# EAGLE schematic node5-frontend (EAGLE 5.11)
DIGIKEY: PDS340DICT-ND
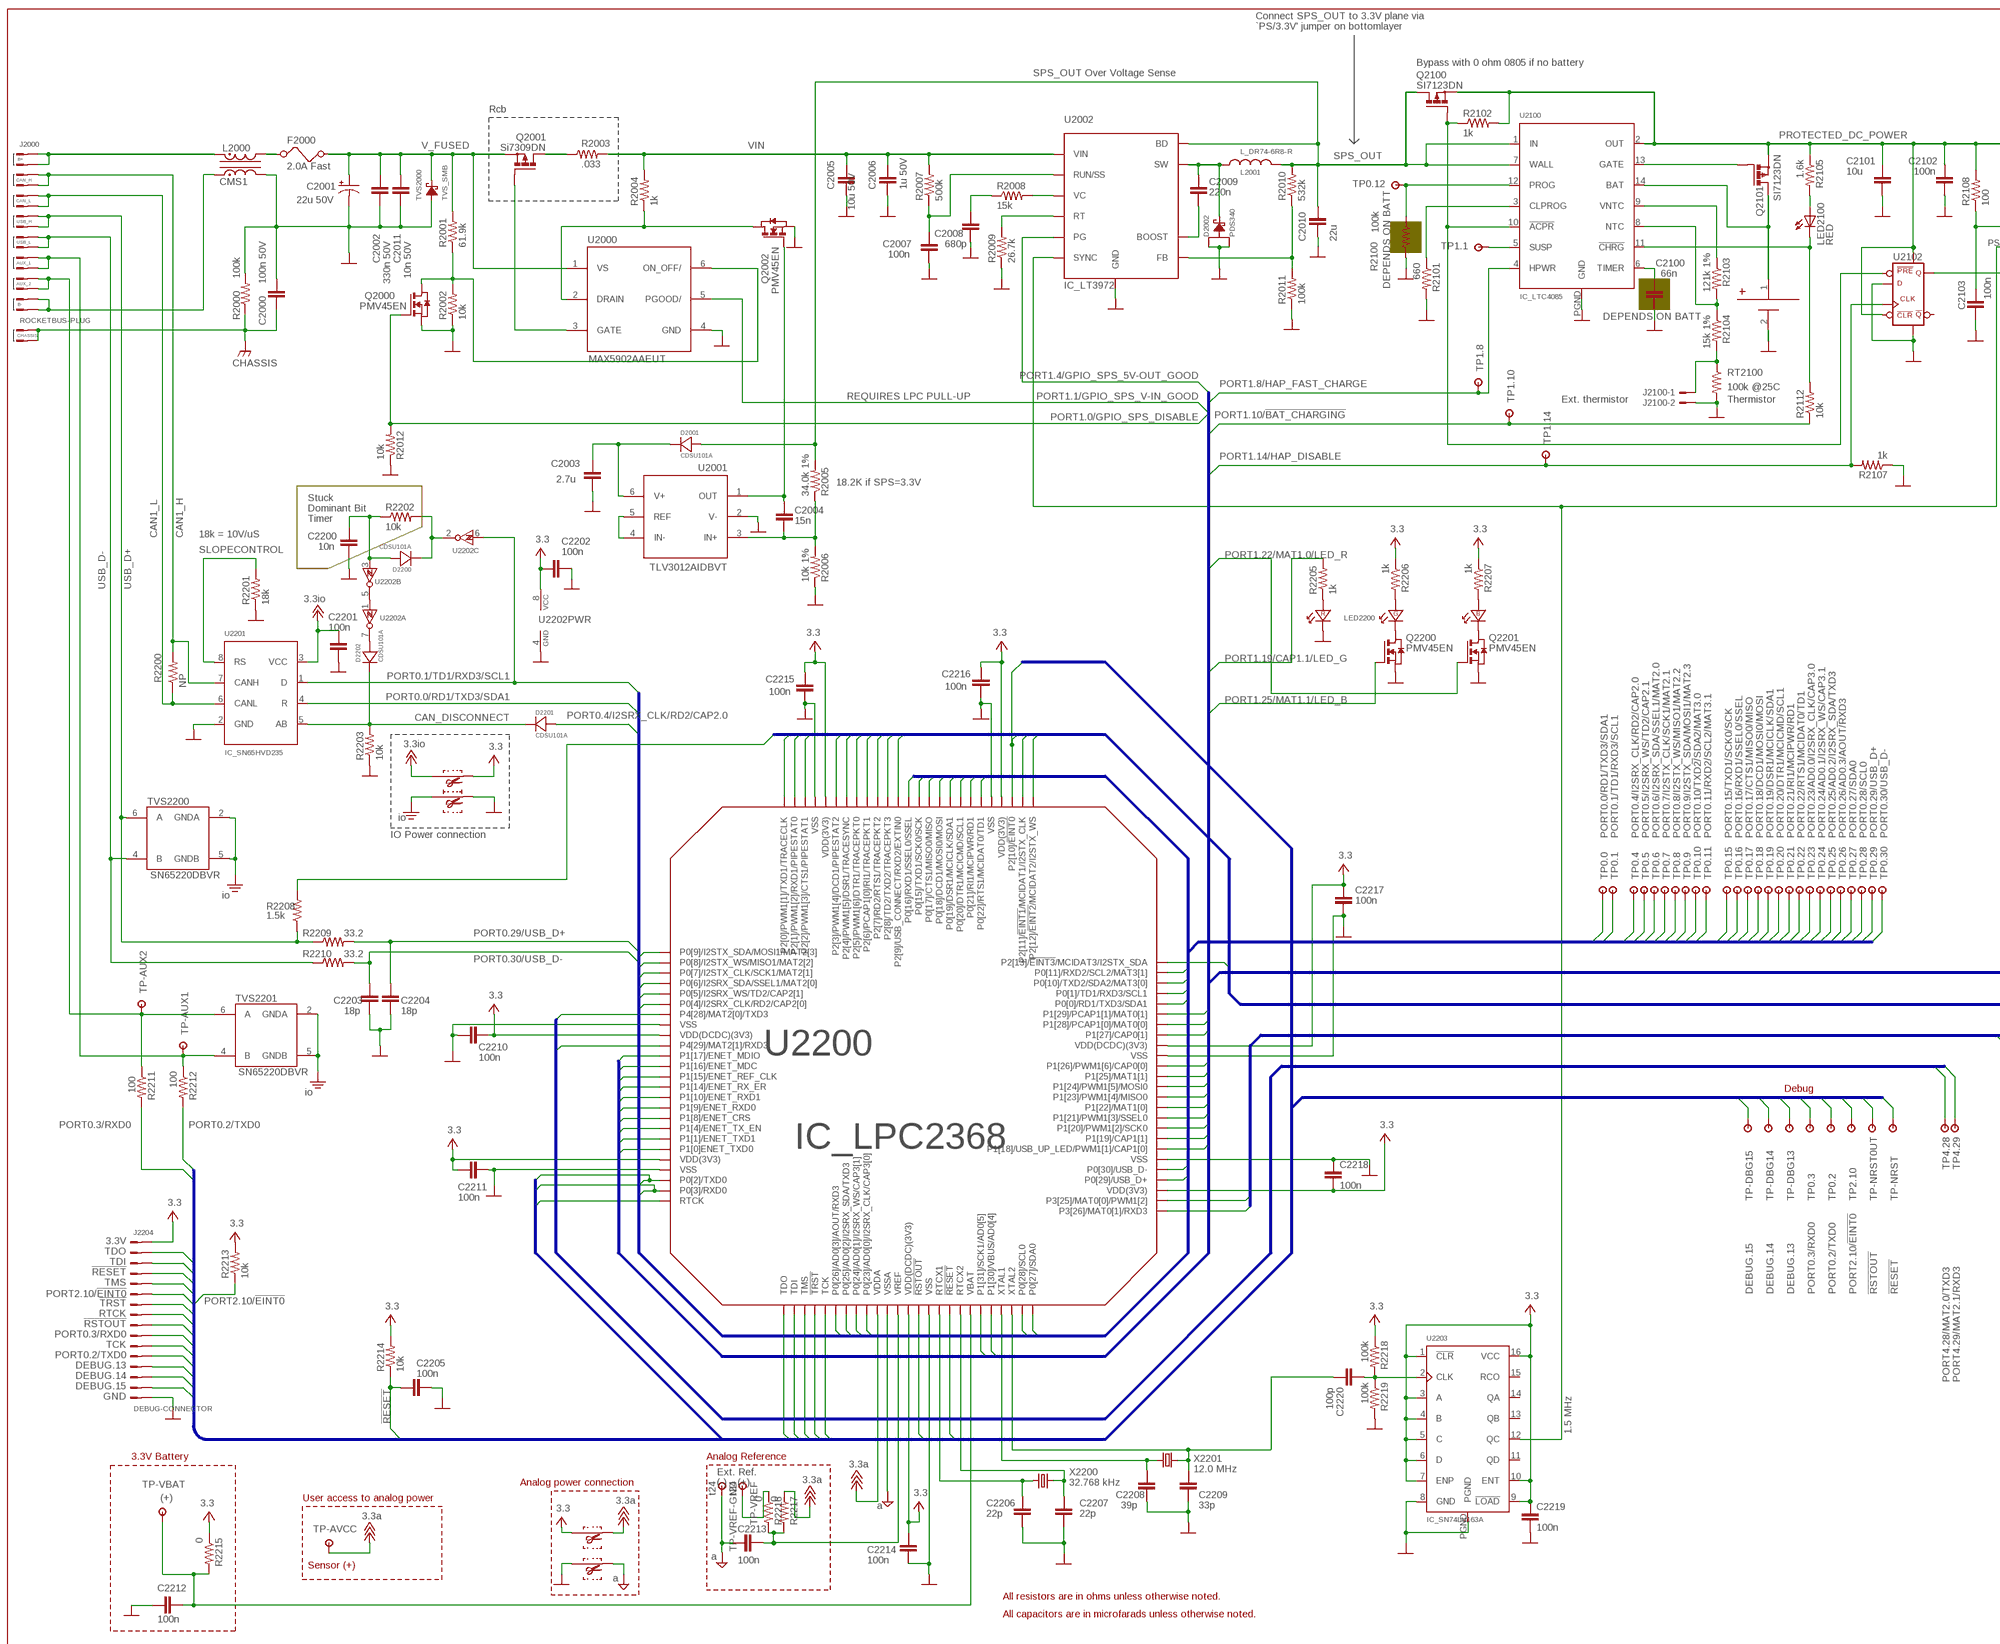
[diagram p0: schematic, sheet 1, part 1 of 2]
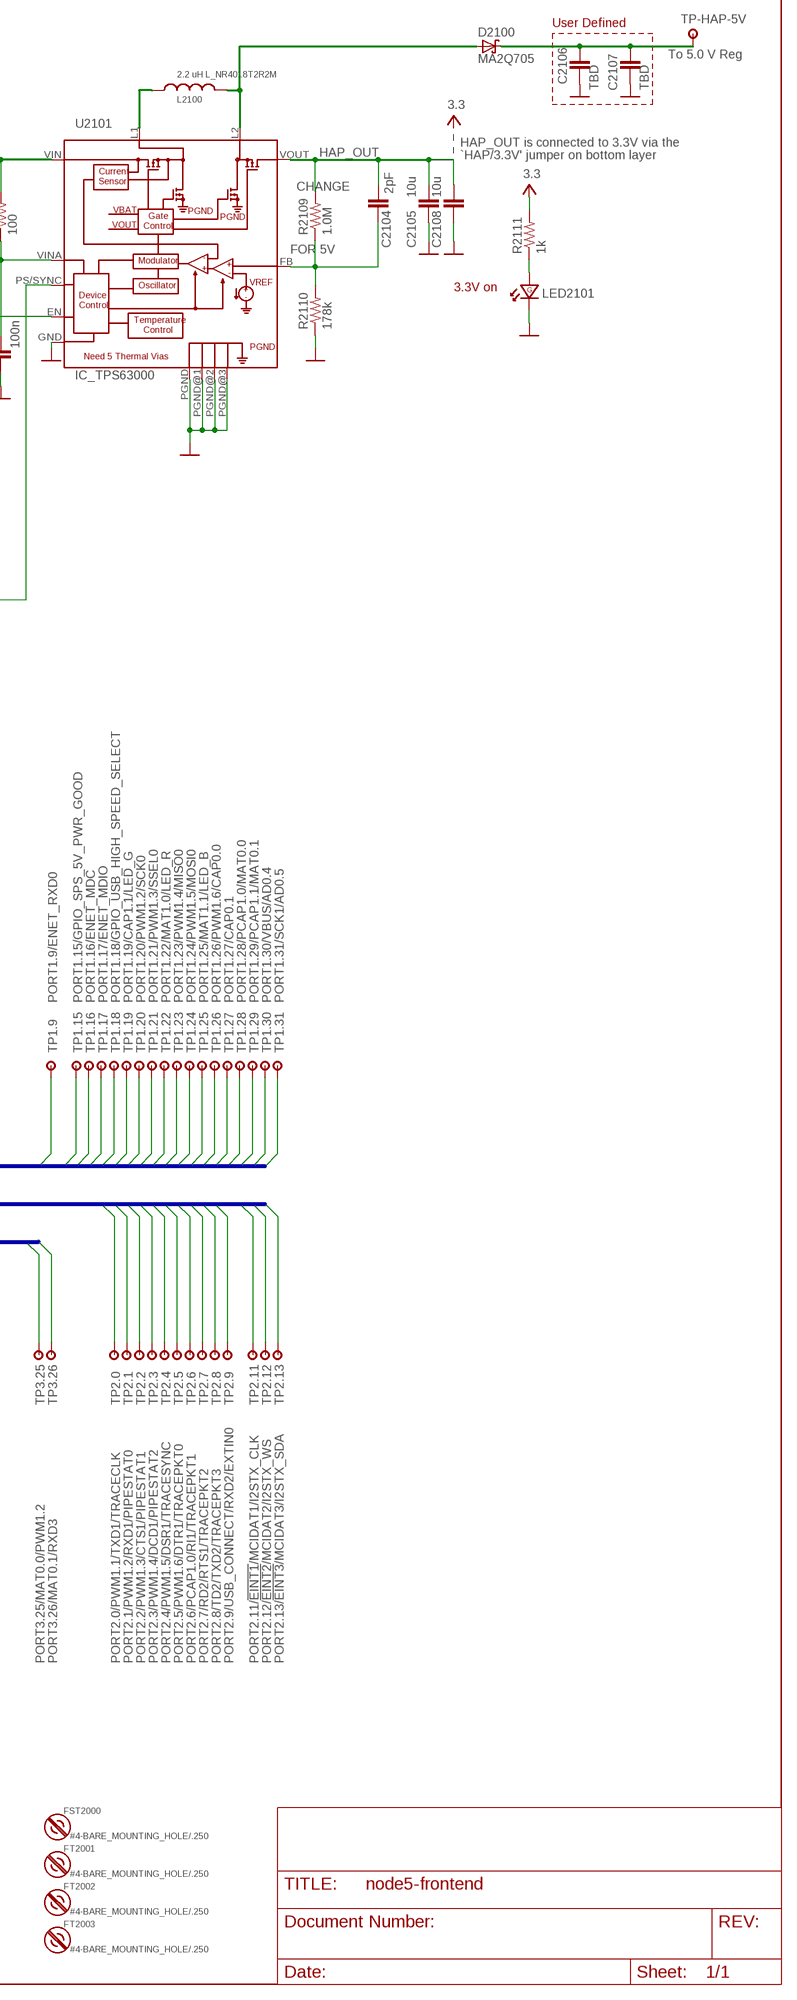
[diagram p1: schematic, sheet 1, part 2 of 2]

## Parts
B2100  BATTERY_SINGLE_CELL_2MM  [2MM-1X2-HEADER]
C2000  100n 50V  C-EU0603-B-NOSILK  [0603-B-NOSILK]
C2001  22u 50V  CPOL-USD/7343-31R  [D/7343-31R]
C2002  330n 50V  C-EU0603-B-NOSILK  [0603-B-NOSILK]
C2003  2.7u  C-EU0603-B-NOSILK  [0603-B-NOSILK]
C2004  15n  C-EU0603-B-NOSILK  [0603-B-NOSILK]
C2005  10u 50V  C-EU1206-B  [1206-B]
C2006  1u 50V  C-EU0805-B-NOSILK  [0805-B-NOSILK]
C2007  100n  C-EU0603-B-NOSILK  [0603-B-NOSILK]
C2008  680p  C-EU0603-B-NOSILK  [0603-B-NOSILK]
C2009  220n  C-EU0603-B-NOSILK  [0603-B-NOSILK]
C2010  22u  C-EUC1210  [C1210]
C2011  10n 50V  C-EU0603-B-NOSILK  [0603-B-NOSILK]
C2100  66n  C-EU0603-B-NOSILK  [0603-B-NOSILK]
C2101  10u  C-EU0805-B-NOSILK  [0805-B-NOSILK]
C2102  100n  C-EU0603-B-NOSILK  [0603-B-NOSILK]
C2103  100n  C-EU0603-B-NOSILK  [0603-B-NOSILK]
C2104  2pF  C-EU0603-B-NOSILK  [0603-B-NOSILK]
C2105  10u  C-EU0805-B-NOSILK  [0805-B-NOSILK]
C2106  TBD  C-EU0603-B-NOSILK  [0603-B-NOSILK]
C2107  TBD  C-EU0603-B-NOSILK  [0603-B-NOSILK]
C2108  10u  C-EU0805-B-NOSILK  [0805-B-NOSILK]
C2200  10n  C-EU0603-B-NOSILK  [0603-B-NOSILK]
C2201  100n  C-EU0603-B-NOSILK  [0603-B-NOSILK]
C2202  100n  C-EU0603-B-NOSILK  [0603-B-NOSILK]
C2203  18p  C-EU0603-B-NOSILK  [0603-B-NOSILK]
C2204  18p  C-EU0603-B-NOSILK  [0603-B-NOSILK]
C2205  100n  C-EU0603-B-NOSILK  [0603-B-NOSILK]
C2206  22p  C-EU0603-B-NOSILK  [0603-B-NOSILK]
C2207  22p  C-EU0603-B-NOSILK  [0603-B-NOSILK]
C2208  39p  C-EU0603-B-NOSILK  [0603-B-NOSILK]
C2209  33p  C-EU0603-B-NOSILK  [0603-B-NOSILK]
C2210  100n  C-EU0603-B-NOSILK  [0603-B-NOSILK]
C2211  100n  C-EU0603-B-NOSILK  [0603-B-NOSILK]
C2212  100n  C-EU0603-B-NOSILK  [0603-B-NOSILK]
C2213  100n  C-EU0603-B-NOSILK  [0603-B-NOSILK]
C2214  100n  C-EU0603-B-NOSILK  [0603-B-NOSILK]
C2215  100n  C-EU0603-B-NOSILK  [0603-B-NOSILK]
C2216  100n  C-EU0603-B-NOSILK  [0603-B-NOSILK]
C2217  100n  C-EU0603-B-NOSILK  [0603-B-NOSILK]
C2218  100n  C-EU0603-B-NOSILK  [0603-B-NOSILK]
C2219  100n  C-EU0603-B-NOSILK  [0603-B-NOSILK]
C2220  100p  C-EU0603-B-NOSILK  [0603-B-NOSILK]
D2001  CDSU101A  DIODE_SILICON-0603  [0603-DIODE]
D2002  PDS340  D_PDS340  [D_POWERDI5]
D2100  MA2Q705  [NMINIP2-J1]
D2200  CDSU101A  DIODE_SILICON-0603  [0603-DIODE]
D2201  CDSU101A  DIODE_SILICON-0603  [0603-DIODE]
D2202  CDSU101A  DIODE_SILICON-0603  [0603-DIODE]
F2000  2.0A Fast  FUSE1206  [1206]
FST2000  #4-BARE_MOUNTING_HOLE/.250  [#4/.250-BARE+STD_WASHER]
FT2001  #4-BARE_MOUNTING_HOLE/.250  [#4/.250-BARE+STD_WASHER]
FT2002  #4-BARE_MOUNTING_HOLE/.250  [#4/.250-BARE+STD_WASHER]
FT2003  #4-BARE_MOUNTING_HOLE/.250  [#4/.250-BARE+STD_WASHER]
J2000  ROCKETBUS-PLUG  [ROCKETBUS-PLUG]
J2100  87758-0216  [87758-0216]
J2204  DEBUG-CONNECTOR  [JST-16R-JED]
JP2200  0603-B-NO-SILK-CUT-JUMPER  [0603-B-NO-SILK-JUMPER]
JP2201  0603-B-NO-SILK-CUT-JUMPER  [0603-B-NO-SILK-JUMPER]
JP2203  0603-B-NO-SILK-CUT-JUMPER  [0603-B-NO-SILK-JUMPER]
JP2204  0603-B-NO-SILK-CUT-JUMPER  [0603-B-NO-SILK-JUMPER]
L2000  CMS1  COIL_CMS1  [CMS1]
L2001  L_DR74-6R8-R  [L-DR74]
L2100  2.2 uH L_NR4018T2R2M  L_NR4018T2R2M  [L_NR4018]
LED2100  RED  LEDCHIP-LED0603  [CHIP-LED0603]
LED2101  LED-GRN-  [0603-DIODE]
LED2200  LED_RGB_PLCC-6  [PLCC-6]
Q2000  PMV45EN  [SOT23]
Q2001  Si7309DN  P-MOS_SI7123DN  [1212-8_POWERPAK]
Q2002  PMV45EN  [SOT23]
Q2100  SI7123DN  P-MOS_SI7123DN  [1212-8_POWERPAK]
Q2101  SI7123DN  P-MOS_SI7123DN  [1212-8_POWERPAK]
Q2200  PMV45EN  [SOT23]
Q2201  PMV45EN  [SOT23]
R2000  100k  R-US_0603-B-NOSILK  [0603-B-NOSILK]
R2001  61.9k  R-US_0603-B-NOSILK  [0603-B-NOSILK]
R2002  10k  R-US_0603-B-NOSILK  [0603-B-NOSILK]
R2003  .033  R-US_0805-B-NOSILK  [0805-B-NOSILK]
R2004  1k  R-US_0603-B-NOSILK  [0603-B-NOSILK]
R2005  34.0k 1%  R-US_0603-B-NOSILK  [0603-B-NOSILK]
R2006  10k 1%  R-US_0603-B-NOSILK  [0603-B-NOSILK]
R2007  500k  R-US_0603-B-NOSILK  [0603-B-NOSILK]
R2008  15k  R-US_0603-B-NOSILK  [0603-B-NOSILK]
R2009  26.7k  R-US_0603-B-NOSILK  [0603-B-NOSILK]
R2010  532k  R-US_0603-B-NOSILK  [0603-B-NOSILK]
R2011  100k  R-US_0603-B-NOSILK  [0603-B-NOSILK]
R2012  10k  R-US_0603-B-NOSILK  [0603-B-NOSILK]
R2100  100k  R-US_0603-B-NOSILK  [0603-B-NOSILK]
R2101  660  R-US_0603-B-NOSILK  [0603-B-NOSILK]
R2102  1k  R-US_0603-B-NOSILK  [0603-B-NOSILK]
R2103  121k 1%  R-US_0603-B-NOSILK  [0603-B-NOSILK]
R2104  15k 1%  R-US_0603-B-NOSILK  [0603-B-NOSILK]
R2105  1.6k  R-US_0603-B-NOSILK  [0603-B-NOSILK]
R2107  1k  R-US_0603-B-NOSILK  [0603-B-NOSILK]
R2108  100  R-US_0603-B-NOSILK  [0603-B-NOSILK]
R2109  1.0M  R-US_0603-B-NOSILK  [0603-B-NOSILK]
R2110  178k  R-US_0603-B-NOSILK  [0603-B-NOSILK]
R2111  1k  R-US_0603-B-NOSILK  [0603-B-NOSILK]
R2112  10k  R-US_0603-B-NOSILK  [0603-B-NOSILK]
R2200  NP  R-US_0603-B-NOSILK  [0603-B-NOSILK]
R2201  18k  R-US_0603-B-NOSILK  [0603-B-NOSILK]
R2202  10k  R-US_0603-B-NOSILK  [0603-B-NOSILK]
R2203  10k  R-US_0603-B-NOSILK  [0603-B-NOSILK]
R2205  1k  R-US_0603-B-NOSILK  [0603-B-NOSILK]
R2206  1k  R-US_0603-B-NOSILK  [0603-B-NOSILK]
R2207  1k  R-US_0603-B-NOSILK  [0603-B-NOSILK]
R2208  1.5k  R-US_0603-B-NOSILK  [0603-B-NOSILK]
R2209  33.2  R-US_0603-B-NOSILK  [0603-B-NOSILK]
R2210  33.2  R-US_0603-B-NOSILK  [0603-B-NOSILK]
R2211  100  R-US_0603-B-NOSILK  [0603-B-NOSILK]
R2212  100  R-US_0603-B-NOSILK  [0603-B-NOSILK]
R2213  10k  R-US_0603-B-NOSILK  [0603-B-NOSILK]
R2214  10k  R-US_0603-B-NOSILK  [0603-B-NOSILK]
R2215  0  R-US_0603-B-NOSILK  [0603-B-NOSILK]
R2216  0  R-US_0603-B-NOSILK  [0603-B-NOSILK]
R2217  0  R-US_0603-B-NOSILK  [0603-B-NOSILK]
R2218  100k  R-US_0603-B-NOSILK  [0603-B-NOSILK]
R2219  100k  R-US_0603-B-NOSILK  [0603-B-NOSILK]
RT2100  100k @25C  R-US_0805-B-NOSILK  [0805-B-NOSILK]
TP0.0  PAD_ROUND016  [PAD_ROUND-APC-FREE_0.1/016]
TP0.1  PAD_ROUND016  [PAD_ROUND-APC-FREE_0.1/016]
TP0.2  PAD_ROUND016  [PAD_ROUND-APC-FREE_0.1/016]
TP0.3  PAD_ROUND016  [PAD_ROUND-APC-FREE_0.1/016]
TP0.4  PAD_ROUND016  [PAD_ROUND-APC-FREE_0.1/016]
TP0.5  PAD_ROUND016  [PAD_ROUND-APC-FREE_0.1/016]
TP0.6  PAD_ROUND016  [PAD_ROUND-APC-FREE_0.1/016]
TP0.7  PAD_ROUND016  [PAD_ROUND-APC-FREE_0.1/016]
TP0.8  PAD_ROUND016  [PAD_ROUND-APC-FREE_0.1/016]
TP0.9  PAD_ROUND016  [PAD_ROUND-APC-FREE_0.1/016]
TP0.10  PAD_ROUND016  [PAD_ROUND-APC-FREE_0.1/016]
TP0.11  PAD_ROUND016  [PAD_ROUND-APC-FREE_0.1/016]
TP0.12  PAD_ROUND016  [PAD_ROUND-APC-FREE_0.1/016]
TP0.15  PAD_ROUND016  [PAD_ROUND-APC-FREE_0.1/016]
TP0.16  PAD_ROUND016  [PAD_ROUND-APC-FREE_0.1/016]
TP0.17  PAD_ROUND016  [PAD_ROUND-APC-FREE_0.1/016]
TP0.18  PAD_ROUND016  [PAD_ROUND-APC-FREE_0.1/016]
TP0.19  PAD_ROUND016  [PAD_ROUND-APC-FREE_0.1/016]
TP0.20  PAD_ROUND016  [PAD_ROUND-APC-FREE_0.1/016]
TP0.21  PAD_ROUND016  [PAD_ROUND-APC-FREE_0.1/016]
TP0.22  PAD_ROUND016  [PAD_ROUND-APC-FREE_0.1/016]
TP0.23  PAD_ROUND016  [PAD_ROUND-APC-FREE_0.1/016]
TP0.24  PAD_ROUND016  [PAD_ROUND-APC-FREE_0.1/016]
TP0.25  PAD_ROUND016  [PAD_ROUND-APC-FREE_0.1/016]
TP0.26  PAD_ROUND016  [PAD_ROUND-APC-FREE_0.1/016]
TP0.27  PAD_ROUND016  [PAD_ROUND-APC-FREE_0.1/016]
TP0.28  PAD_ROUND016  [PAD_ROUND-APC-FREE_0.1/016]
TP0.29  PAD_ROUND016  [PAD_ROUND-APC-FREE_0.1/016]
TP0.30  PAD_ROUND016  [PAD_ROUND-APC-FREE_0.1/016]
TP1.1  PAD_ROUND016  [PAD_ROUND-APC-FREE_0.1/016]
TP1.8  PAD_ROUND016  [PAD_ROUND-APC-FREE_0.1/016]
TP1.9  PAD_ROUND016  [PAD_ROUND-APC-FREE_0.1/016]
TP1.10  PAD_ROUND016  [PAD_ROUND-APC-FREE_0.1/016]
TP1.14  PAD_ROUND016  [PAD_ROUND-APC-FREE_0.1/016]
TP1.15  PAD_ROUND016  [PAD_ROUND-APC-FREE_0.1/016]
TP1.16  PAD_ROUND016  [PAD_ROUND-APC-FREE_0.1/016]
TP1.17  PAD_ROUND016  [PAD_ROUND-APC-FREE_0.1/016]
TP1.18  PAD_ROUND016  [PAD_ROUND-APC-FREE_0.1/016]
TP1.19  PAD_ROUND016  [PAD_ROUND-APC-FREE_0.1/016]
TP1.20  PAD_ROUND016  [PAD_ROUND-APC-FREE_0.1/016]
TP1.21  PAD_ROUND016  [PAD_ROUND-APC-FREE_0.1/016]
TP1.22  PAD_ROUND016  [PAD_ROUND-APC-FREE_0.1/016]
TP1.23  PAD_ROUND016  [PAD_ROUND-APC-FREE_0.1/016]
TP1.24  PAD_ROUND016  [PAD_ROUND-APC-FREE_0.1/016]
TP1.25  PAD_ROUND016  [PAD_ROUND-APC-FREE_0.1/016]
TP1.26  PAD_ROUND016  [PAD_ROUND-APC-FREE_0.1/016]
TP1.27  PAD_ROUND016  [PAD_ROUND-APC-FREE_0.1/016]
TP1.28  PAD_ROUND016  [PAD_ROUND-APC-FREE_0.1/016]
TP1.29  PAD_ROUND016  [PAD_ROUND-APC-FREE_0.1/016]
TP1.30  PAD_ROUND016  [PAD_ROUND-APC-FREE_0.1/016]
TP1.31  PAD_ROUND016  [PAD_ROUND-APC-FREE_0.1/016]
TP2.0  PAD_ROUND016  [PAD_ROUND-APC-FREE_0.1/016]
TP2.1  PAD_ROUND016  [PAD_ROUND-APC-FREE_0.1/016]
TP2.2  PAD_ROUND016  [PAD_ROUND-APC-FREE_0.1/016]
TP2.3  PAD_ROUND016  [PAD_ROUND-APC-FREE_0.1/016]
TP2.4  PAD_ROUND016  [PAD_ROUND-APC-FREE_0.1/016]
TP2.5  PAD_ROUND016  [PAD_ROUND-APC-FREE_0.1/016]
TP2.6  PAD_ROUND016  [PAD_ROUND-APC-FREE_0.1/016]
TP2.7  PAD_ROUND016  [PAD_ROUND-APC-FREE_0.1/016]
TP2.8  PAD_ROUND016  [PAD_ROUND-APC-FREE_0.1/016]
TP2.9  PAD_ROUND016  [PAD_ROUND-APC-FREE_0.1/016]
TP2.10  PAD_ROUND016  [PAD_ROUND-APC-FREE_0.1/016]
TP2.11  PAD_ROUND016  [PAD_ROUND-APC-FREE_0.1/016]
TP2.12  PAD_ROUND016  [PAD_ROUND-APC-FREE_0.1/016]
TP2.13  PAD_ROUND016  [PAD_ROUND-APC-FREE_0.1/016]
TP3.25  PAD_ROUND016  [PAD_ROUND-APC-FREE_0.1/016]
TP3.26  PAD_ROUND016  [PAD_ROUND-APC-FREE_0.1/016]
TP4.28  PAD_ROUND016  [PAD_ROUND-APC-FREE_0.1/016]
TP4.29  PAD_ROUND016  [PAD_ROUND-APC-FREE_0.1/016]
TP-AUX1  PAD_ROUND016  [PAD_ROUND-APC-FREE_0.1/016]
TP-AUX2  PAD_ROUND016  [PAD_ROUND-APC-FREE_0.1/016]
TP-AVCC  PAD_ROUND016  [PAD_ROUND-APC-FREE_0.1/016]
TP-DBG13  PAD_ROUND016  [PAD_ROUND-APC-FREE_0.1/016]
TP-DBG14  PAD_ROUND016  [PAD_ROUND-APC-FREE_0.1/016]
TP-DBG15  PAD_ROUND016  [PAD_ROUND-APC-FREE_0.1/016]
TP-HAP-5V  t24  PAD_ROUND016  [PAD_ROUND-APC-FREE_0.1/016]
TP-NRST  PAD_ROUND016  [PAD_ROUND-APC-FREE_0.1/016]
TP-NRST0UT  PAD_ROUND016  [PAD_ROUND-APC-FREE_0.1/016]
TP-VBAT  t24  PAD_ROUND016  [PAD_ROUND-APC-FREE_0.1/016]
TP-VREF  t24  PAD_ROUND016  [PAD_ROUND-APC-FREE_0.1/016]
TP-VREF-GND  t24  PAD_ROUND016  [PAD_ROUND-APC-FREE_0.1/016]
TVS2000  TVS_SMB  [DO-214AA/SMB]
TVS2200  SN65220DBVR  IC_SN65220  [SOT23-6]
TVS2201  SN65220DBVR  IC_SN65220  [SOT23-6]
U2000  MAX5902AAEUT  IC_MAX5902  [SOT23-6]
U2001  TLV3012AIDBVT  IC_TLV3012  [SOT23-6]
U2002  IC_LT3972  [DFN-10]
U2100  IC_LTC4085  [DFN-14]
U2101  IC_TPS63000  [SON-10]
U2102  IC_741G74-VSSOP8  [VSSOP-8]
U2200  IC_LPC2368  [LQFP100]
U2201  IC_SN65HVD235  [DR-PDSO-G8]
U2202  74LVC3G14DCU  [DCU]
U2203  IC_SN74LV163A  [QFN-16]
X2200  32.768 kHz  XTAL_CM415  [CM415]
X2201  12.0 MHz  XTAL_CS10  [CS10]

## Nets
3.3V: C2202.1 C2210.1 C2211.1 C2214.1 C2215.1 C2216.1 C2217.2 C2218.2 C2219.1 J2204.1(3.3V) JP2200.2(P1) JP2203.1(P0) R2111.2 R2206.1 R2207.1 R2213.2 R2214.2 R2215.1 R2218.1 U2200.VDD(3V3) U2200.VDD(3V3)@1(VDD(3V3)) U2200.VDD(3V3)@2(VDD(3V3)) U2200.VDD(3V3)@3(VDD(3V3)) U2200.VDD(DCDC)(3V3) U2200.VDD(DCDC)(3V3)@1(VDD(DCDC)(3V3)) U2200.VDD(DCDC)(3V3)@2(VDD(DCDC)(3V3)) U2202.8(PWR:VCC) U2203.1(!CLR!) U2203.3(A) U2203.4(B) U2203.5(C) U2203.6(D) U2203.7(ENP) U2203.9(!LOAD!) U2203.10(ENT) U2203.16(VCC) ; supply symbol labelled 3.3
!RESET!: C2205.1 J2204.4(!RESET) R2214.1 TP-NRST.PAD U2200.#RESET(!RESET!)
!RSTOUT!: J2204.9(!RSTOUT) TP-NRST0UT.PAD U2200.#RSTOUT(!RSTOUT!)
!SPS_POWER_PRESENT!: Q2100.4(G) R2102.1 U2100.10(!ACPR!) U2102.7(U:!PRE)
!TRST!: J2204.7(!TRST) U2200.#TRST(!TRST!)
A_3P3: JP2203.2(P1) R2217.1 TP-AVCC.PAD U2200.VDDA ; supply symbol labelled 3.3a
A_GND: C2213.1 JP2204.2(P1) TP-VREF-GND.PAD U2200.VSSA ; supply symbol labelled a
AUX_1.2: J2000.AUX_1@11(AUX_1) J2000.AUX_1@12(AUX_1) R2212.1 TP-AUX1.PAD TVS2201.4(B)
AUX_2.2: J2000.AUX_2@13(AUX_2) J2000.AUX_2@14(AUX_2) R2211.1 TP-AUX2.PAD TVS2201.6(A)
B+: J2000.B+@1(B+) J2000.B+@2(B+) L2000.4
B-: J2000.B-@15(B-) J2000.B-@16(B-) L2000.1
BATTERY_CHARGE: B2100.1(B+) Q2101.5-6-7-8(D) U2100.14(BAT)
BATTERY_CONNECT_CONTROL: Q2101.4(G) U2100.13(GATE)
BIAS_VOLTS_FOR_NTC_THERMISTOR: R2103.1 U2100.9(VNTC)
BIN: F2000.1 L2000.3
CAN1_H: J2000.CAN_H@3(CAN_H) J2000.CAN_H@4(CAN_H) R2200.2 U2201.7(CANH)
CAN1_L: J2000.CAN_L@5(CAN_L) J2000.CAN_L@6(CAN_L) R2200.1 U2201.6(CANL)
CAN_DISCONNECT: D2201.K(CATHODE) D2202.K(CATHODE) R2203.2 U2201.5(AB)
CHARGE_TIMER: C2100.2 U2100.6(TIMER)
CHASSIS: C2000.1 J2000.CHASSIS@1(CHASSIS) J2000.CHASSIS@2(CHASSIS) R2000.1
CPU_VREF: C2213.2 R2216.2 R2217.2 U2200.VREF
CPU_XTAL1: C2208.2 U2200.XTAL1 X2201.P$1
CPU_XTAL2: C2209.2 C2220.1 U2200.XTAL2 X2201.P$2
DEBUG.13: J2204.13(DEBUG.13) TP-DBG13.PAD
DEBUG.14: J2204.14(DEBUG.14) TP-DBG14.PAD
DEBUG.15: J2204.15(DEBUG.15) TP-DBG15.PAD
DOMINANT_BIT_STUCK_WHEN_HIGH: C2200.2 D2200.A(ANODE) R2202.1 U2202.3(B:A)
EXT_VREF: R2216.1 TP-VREF.PAD
FB: C2104.1 R2109.1 R2110.2 U2101.FB
GND: B2100.2(B-) C2000.2 C2001.- C2002.1 C2003.1 C2005.2 C2006.2 C2007.1 C2008.1 C2010.2 C2011.1 C2100.1 C2101.1 C2102.1 C2103.1 C2105.1 C2106.1 C2107.1 C2108.1 C2200.1 C2201.2 C2202.2 C2203.1 C2204.1 C2205.2 C2206.1 C2207.1 C2208.1 C2209.1 C2210.2 C2211.2 C2212.2 C2214.2 C2215.2 C2216.2 C2217.1 C2218.1 C2219.2 D2002.ANODE1 D2002.ANODE2 J2100.2 J2204.16(GRND) JP2201.2(P1) JP2204.1(P0) L2000.2 LED2101.K(CATHODE) LED2200.6(R:K) Q2000.2(S) Q2002.2(S) Q2200.2(S) Q2201.2(S) R2000.2 R2002.1 R2006.1 R2009.1 R2011.1 R2012.1 R2100.2 R2101.2 R2107.1 R2110.1 R2201.1 R2203.1 R2219.2 RT2100.2 TVS2000.ANODE U2000.4(GND) U2001.2(V-) U2002.GND U2100.PGND(GND) U2101.GND U2101.PGND U2101.PGND@1(PGND) U2101.PGND@2(PGND) U2101.PGND@3(PGND) U2102.2(U:D) U2102.4(GND:GND) U2200.VSS U2200.VSS@1(VSS) U2200.VSS@2(VSS) U2200.VSS@3(VSS) U2200.VSS@4(VSS) U2200.VSS@5(VSS) U2200.VSS@6(VSS) U2201.2(GND) U2202.4(PWR:GND) U2203.8(GND) U2203.PGND
HAP_OUT: C2104.2 C2105.2 C2108.2 R2109.2 U2101.VOUT
IN+: C2004.1 R2005.1 R2006.2 U2001.3(IN+)
IN_CURRENT_LIMIT_PROG: R2101.1 U2100.3(CLPROG)
INV-INV: U2202.1(A:A) U2202.5(B:Y)
IO_3P3: C2201.1 JP2200.1(P0) U2201.3(VCC) ; supply symbol labelled 3.3io
IO_GND: JP2201.1(P0) TVS2200.2(GNDA) TVS2200.5(GNDB) TVS2201.2(GNDA) TVS2201.5(GNDB) ; supply symbol labelled io
L_IN: L2100.1 U2101.L1
L_OUT: D2100.A L2100.2 U2101.L2
MAX_UVLO: Q2000.3(D) R2001.1 R2002.2 U2000.6(ON_OFF/)
N$2: D2200.K(CATHODE) R2202.2 U2202.2(C:Y)
N$3: R2008.2 U2002.VC
N$4: R2009.2 U2002.RT
N$5: C2008.2 R2008.1
N$6: D2202.A(ANODE) U2202.7(A:Y)
N$7: LED2100.A R2105.2
N$10: J2100.1 R2104.2 RT2100.1
N$303: LED2200.1(R:A) R2205.1
N$316: LED2200.2(G:K) Q2200.3(D)
N$331: LED2200.3(G:A) R2206.2
N$332: LED2200.5(B:K) Q2201.3(D)
N$333: LED2200.4(B:A) R2207.2
N$334: Q2001.5-6-7-8(D) R2003.1
N$335: TP1.1.PAD U2100.5(SUSP)
N$336: LED2100.C R2112.2 U2100.11(!CHRG!)
N$337: C2220.2 R2218.2 R2219.1 U2203.2(CLK)
N$338: C2103.2 R2108.1 U2101.VINA
N_DRAIN: Q2002.3(D) R2004.1 U2000.2(DRAIN)
N_GATE: C2004.2 Q2002.1(G) U2001.1(OUT)
NTC_INPUT_FROM_BATTERY: R2103.2 R2104.1 U2100.8(NTC)
P_GATE: Q2001.4(G) U2000.3(GATE)
PORT0.0/RD1/TXD3/SDA1: TP0.0.PAD U2200.P0[0]/RD1/TXD3/SDA1 U2201.4(R)
PORT0.1/TD1/RXD3/SCL1: TP0.1.PAD U2200.P0[1]/TD1/RXD3/SCL1 U2201.1(D) U2202.6(C:A)
PORT0.2/TXD0: J2204.12(PORT0.2/TXD0) R2212.2 TP0.2.PAD U2200.P0[2]/TXD0
PORT0.3/RXD0: J2204.10(PORT0.3/RXD0) R2211.2 TP0.3.PAD U2200.P0[3]/RXD0
PORT0.4/I2SRX_CLK/RD2/CAP2.0: D2201.A(ANODE) TP0.4.PAD U2200.P0[4]/I2SRX_CLK/RD2/CAP2[0]
PORT0.5/I2SRX_WS/TD2/CAP2.1: TP0.5.PAD U2200.P0[5]/I2SRX_WS/TD2/CAP2[1]
PORT0.6/I2SRX_SDA/SSEL1/MAT2.0: TP0.6.PAD U2200.P0[6]/I2SRX_SDA/SSEL1/MAT2[0]
PORT0.7/I2STX_CLK/SCK1/MAT2.1: TP0.7.PAD U2200.P0[7]/I2STX_CLK/SCK1/MAT2[1]
PORT0.8/I2STX_WS/MISO1/MAT2.2: TP0.8.PAD U2200.P0[8]/I2STX_WS/MISO1/MAT2[2]
PORT0.9/I2STX_SDA/MOSI1/MAT2.3: TP0.9.PAD U2200.P0[9]/I2STX_SDA/MOSI1/MAT2[3]
PORT0.10/TXD2/SDA2/MAT3.0: TP0.10.PAD U2200.P0[10]/TXD2/SDA2/MAT3[0]
PORT0.11/RXD2/SCL2/MAT3.1: TP0.11.PAD U2200.P0[11]/RXD2/SCL2/MAT3[1]
PORT0.15/TXD1/SCK0/SCK: TP0.15.PAD U2200.P0[15]/TXD1/SCK0/SCK
PORT0.16/RXD1/SSEL0/SSEL: TP0.16.PAD U2200.P0[16]/RXD1/SSEL0/SSEL
PORT0.17/CTS1/MISO0/MISO: TP0.17.PAD U2200.P0[17]/CTS1/MISO0/MISO
PORT0.18/DCD1/MOSI0/MOSI: TP0.18.PAD U2200.P0[18]/DCD1/MOSI0/MOSI
PORT0.19/DSR1/MCICLK/SDA1: TP0.19.PAD U2200.P0[19]/DSR1/MCICLK/SDA1
PORT0.20/DTR1/MCICMD/SCL1: TP0.20.PAD U2200.P0[20]/DTR1/MCICMD/SCL1
PORT0.21/RI1/MCIPWR/RD1: TP0.21.PAD U2200.P0[21]/RI1/MCIPWR/RD1
PORT0.22/RTS1/MCIDAT0/TD1: TP0.22.PAD U2200.P0[22]/RTS1/MCIDAT0/TD1
PORT0.23/AD0.0/I2SRX_CLK/CAP3.0: TP0.23.PAD U2200.P0[23]/AD0[0]/I2SRX_CLK/CAP3[0]
PORT0.24/AD0.1/I2SRX_WS/CAP3.1: TP0.24.PAD U2200.P0[24]/AD0[1]/I2SRX_WS/CAP3[1]
PORT0.25/AD0.2/I2SRX_SDA/TXD3: TP0.25.PAD U2200.P0[25]/AD0[2]/I2SRX_SDA/TXD3
PORT0.26/AD0.3/AOUT/RXD3: TP0.26.PAD U2200.P0[26]/AD0[3]/AOUT/RXD3
PORT0.27/SDA0: TP0.27.PAD U2200.P0[27]/SDA0
PORT0.28/SCL0: TP0.28.PAD U2200.P0[28]/SCL0
PORT0.29/USB_D+: C2204.2 R2209.2 TP0.29.PAD U2200.P0[29]/USB_D+
PORT0.30/USB_D-: C2203.2 R2210.2 TP0.30.PAD U2200.P0[30]/USB_D-
PORT1.0/GPIO_SPS_DISABLE: Q2000.1(G) R2012.2 U2200.P1[0]/ENET_TXD0(P1[0]ENET_TXD0)
PORT1.1/GPIO_SPS_V-IN_GOOD: U2000.5(PGOOD/) U2200.P1[1]/ENET_TXD1
PORT1.4/GPIO_SPS_5V-OUT_GOOD: U2002.PG U2200.P1[4]/ENET_TX_EN
PORT1.8/HAP_FAST_CHARGE: TP1.8.PAD U2100.4(HPWR) U2200.P1[8]/ENET_CRS
PORT1.9/ENET_RXD0: TP1.9.PAD U2200.P1[9]/ENET_RXD0
PORT1.10/!BAT_CHARGING: R2112.1 TP1.10.PAD U2200.P1[10]/ENET_RXD1
PORT1.14/HAP_DISABLE: R2107.2 TP1.14.PAD U2102.1(U:CLK) U2200.P1[14]/ENET_RX_ER
PORT1.15/GPIO_SPS_5V_PWR_GOOD: TP1.15.PAD U2200.P1[15]/ENET_REF_CLK
PORT1.16/ENET_MDC: TP1.16.PAD U2200.P1[16]/ENET_MDC
PORT1.17/ENET_MDIO: TP1.17.PAD U2200.P1[17]/ENET_MDIO
PORT1.18/GPIO_USB_HIGH_SPEED_SELECT: TP1.18.PAD U2200.P1[18]/USB_UP_LED/PWM1[1]/CAP1[0]
PORT1.19/CAP1.1/LED_G: R2205.2 TP1.19.PAD U2200.P1[19]/CAP1[1]
PORT1.20/PWM1.2/SCK0: TP1.20.PAD U2200.P1[20]/PWM1[2]/SCK0
PORT1.21/PWM1.3/SSEL0: TP1.21.PAD U2200.P1[21]/PWM1[3]/SSEL0
PORT1.22/MAT1.0/LED_R: Q2201.1(G) TP1.22.PAD U2200.P1[22]MAT1[0](P1[22]/MAT1[0])
PORT1.23/PWM1.4/MISO0: TP1.23.PAD U2200.P1[23]/PWM1[4]/MISO0
PORT1.24/PWM1.5/MOSI0: TP1.24.PAD U2200.P1[24]/PWM1[5]/MOSI0
PORT1.25/MAT1.1/LED_B: Q2200.1(G) TP1.25.PAD U2200.P1[25]/MAT1[1]
PORT1.26/PWM1.6/CAP0.0: TP1.26.PAD U2200.P1[26]/PWM1[6]/CAP0[0]
PORT1.27/CAP0.1: TP1.27.PAD U2200.P1[27]/CAP0[1]
PORT1.28/PCAP1.0/MAT0.0: TP1.28.PAD U2200.P1[28]/PCAP1[0]/MAT0[0]
PORT1.29/PCAP1.1/MAT0.1: TP1.29.PAD U2200.P1[29]/PCAP1[1]/MAT0[1]
PORT1.30/VBUS/AD0.4: TP1.30.PAD U2200.P1[30]/VBUS/AD0[4]
PORT1.31/SCK1/AD0.5: TP1.31.PAD U2200.P1[31]/SCK1/AD0[5]
PORT2.0/PWM1.1/TXD1/TRACECLK: TP2.0.PAD U2200.P2[0]/PWM1[1]/TXD1/TRACECLK
PORT2.1/PWM1.2/RXD1/PIPESTAT0: TP2.1.PAD U2200.P2[1]/PWM1[2]/RXD1/PIPESTAT0
PORT2.2/PWM1.3/CTS1/PIPESTAT1: TP2.2.PAD U2200.P2[2]/PWM1[3]/CTS1/PIPESTAT1
PORT2.3/PWM1.4/DCD1/PIPESTAT2: TP2.3.PAD U2200.P2[3]/PWM1[4]/DCD1/PIPESTAT2
PORT2.4/PWM1.5/DSR1/TRACESYNC: TP2.4.PAD U2200.P2[4]/PWM1[5]/DSR1/TRACESYNC
PORT2.5/PWM1.6/DTR1/TRACEPKT0: TP2.5.PAD U2200.P2[5]/PWM1[6]/DTR1/TRACEPKT0
PORT2.6/PCAP1.0/RI1/TRACEPKT1: TP2.6.PAD U2200.P2[6]/PCAP1[0]/RI1/TRACEPKT1
PORT2.7/RD2/RTS1/TRACEPKT2: TP2.7.PAD U2200.P2[7]/RD2/RTS1/TRACEPKT2
PORT2.8/TD2/TXD2/TRACEPKT3: TP2.8.PAD U2200.P2[8]/TD2/TXD2/TRACEPKT3
PORT2.9/USB_CONNECT/RXD2/EXTIN0: R2208.2 TP2.9.PAD U2200.P2[9]/USB_CONNECT/RXD2/EXTIN0
PORT2.10/!EINT0!: J2204.6(PORT2.10/!EINT0) R2213.1 TP2.10.PAD U2200.P2[10]/#EINT0(P2[10]/!EINT0!)
PORT2.11/!EINT1!/MCIDAT1/I2STX_CLK: TP2.11.PAD U2200.P2[11]/#EINT1/MCIDAT1/I2STX_CLK(P2[11]/!EINT1!/MCIDAT1/I2STX_CLK)
PORT2.12/!EINT2!/MCIDAT2/I2STX_WS: TP2.12.PAD U2200.P2[12]/#EINT2/MCIDAT2/I2STX_WS(P2[12]/!EINT2!/MCIDAT2/I2STX_WS)
PORT2.13/!EINT3!/MCIDAT3/I2STX_SDA: TP2.13.PAD U2200.P2[13]/#EINT3/MCIDAT3/I2STX_SDA(P2[13]/!EINT3!/MCIDAT3/I2STX_SDA)
PORT3.25/MAT0.0/PWM1.2: TP3.25.PAD U2200.P3[25]/MAT0[0]/PWM1[2]
PORT3.26/MAT0.1/RXD3: TP3.26.PAD U2200.P3[26]/MAT0[1]/PWM1[3](P3[26]/MAT0[1]/RXD3)
PORT4.28/MAT2.0/TXD3: TP4.28.PAD U2200.P4[28]/MAT2[0]/TXD3
PORT4.29/MAT2.1/RXD3: TP4.29.PAD U2200.P4[29]/MAT2[1]/RXD3
PROG: R2100.1 TP0.12.PAD U2100.12(PROG)
PROTECTED_DC_POWER: C2101.2 C2102.2 Q2100.1-2-3(S) Q2101.1-2-3(S) R2102.2 R2105.1 R2108.2 U2100.2(OUT) U2101.VIN U2102.6(U:!CLR) U2102.8(VCC:VCC)
REF: U2001.4(IN-) U2001.5(REF)
RTC_XTAL-A: C2206.2 U2200.RTCX1 X2200.P$2
RTC_XTAL-B: C2207.2 U2200.RTCX2 X2200.P$1
RTCK: J2204.8(RTCK) U2200.RTCK
SLOPECONTROL: R2201.2 U2201.8(RS)
SOFT_START: C2007.2 R2007.1 U2002.RUN/SS
SPS_3P3_LED: LED2101.A(ANODE) R2111.1
SPS_5_REG: C2106.2 C2107.2 D2100.C TP-HAP-5V.PAD
SPS_OUT: C2010.1 D2001.A(ANODE) L2001.2 Q2100.5-6-7-8(D) R2005.2 R2010.2 U2002.BD U2100.1(IN) U2100.7(WALL)
SPS_SYNC: U2002.SYNC U2101.PS/SYNC U2203.12(QC)
TCK: J2204.11(TCK) U2200.TCK
TDI: J2204.3(TDI) U2200.TDI
TDO: J2204.2(TDO) U2200.TDO
TMS: J2204.5(TMS) U2200.TMS
TP-VBAT: C2212.1 R2215.2 TP-VBAT.PAD U2200.VBAT
USB_D+: J2000.USB_H@7(USB_H) J2000.USB_H@8(USB_H) R2208.1 R2209.1 TVS2200.6(A)
USB_D-: J2000.USB_L@9(USB_L) J2000.USB_L@10(USB_L) R2210.1 TVS2200.4(B)
V+: C2003.2 D2001.K(CATHODE) U2001.6(V+)
V_BOOST: C2009.1 U2002.BOOST
V_FEEDBACK: R2010.1 R2011.2 U2002.FB
V_FUSED: C2001.+ C2002.2 C2011.2 F2000.2 Q2001.1-2-3(S) R2001.2 TVS2000.CATHODE U2000.1(VS)
V_SWITCH: C2009.2 D2002.CATHODE L2001.1 U2002.SW
VIN: C2005.1 C2006.1 R2003.2 R2004.2 R2007.2 U2002.VIN
VINA: U2101.EN U2102.5(U:Q)
Unconnected: U2102.3(U:!Q) U2203.11(QD) U2203.13(QB) U2203.14(QA) U2203.15(RCO)

## Buses
!RESET!,!RSTOUT!,RTCK,TCK,TDI,TDO,TMS,!TRST!,PORT2.10/!EINT0!,PORT0.2/TXD0,PORT0.3/RXD0,DEBUG.13,DEBUG.14,DEBUG.15,GND
PORT0.0/RD1/TXD3/SDA1,PORT0.1/TD1/RXD3/SCL1,PORT0.2/TXD0,PORT0.3/RXD0,PORT0.4/I2SRX_CLK/RD2/CAP2.0,PORT0.5/I2SRX_WS/TD2/CAP2.1,PORT0.6/I2SRX_SDA/SSEL1/MAT2.0,PORT0.7/I2STX_CLK/SCK1/MAT2.1,PORT0.8/I2STX_WS/MISO1/MAT2.2,PORT0.9/I2STX_SDA/MOSI1/MAT2.3,PORT0.10/TXD2/SDA2/MAT3.0,PORT0.11/RXD2/SCL2/MAT3.1,PORT0.15/TXD1/SCK0/SCK,PORT0.16/RXD1/SSEL0/SSEL,PORT0.17/CTS1/MISO0/MISO,PORT0.18/DCD1/MOSI0/MOSI,PORT0.19/DSR1/MCICLK/SDA1,PORT0.20/DTR1/MCICMD/SCL1,PORT0.21/RI1/MCIPWR/RD1,PORT0.22/RTS1/MCIDAT0/TD1,PORT0.23/AD0.0/I2SRX_CLK/CAP3.0,PORT0.24/AD0.1/I2SRX_WS/CAP3.1,PORT0.25/AD0.2/I2SRX_SDA/TXD3,PORT0.26/AD0.3/AOUT/RXD3,PORT0.27/SDA0,PORT0.28/SCL0,PORT0.29/USB_D+,PORT0.30/USB_D-
PORT4.28/MAT2.0/TXD3,PORT4.29/MAT2.1/RXD3
PORT2.0/PWM1.1/TXD1/TRACECLK,PORT2.1/PWM1.2/RXD1/PIPESTAT0,PORT2.2/PWM1.3/CTS1/PIPESTAT1,PORT2.3/PWM1.4/DCD1/PIPESTAT2,PORT2.4/PWM1.5/DSR1/TRACESYNC,PORT2.5/PWM1.6/DTR1/TRACEPKT0,PORT2.6/PCAP1.0/RI1/TRACEPKT1,PORT2.7/RD2/RTS1/TRACEPKT2,PORT2.8/TD2/TXD2/TRACEPKT3,PORT2.9/USB_CONNECT/RXD2/EXTIN0,PORT2.10/!EINT0!,PORT2.11/!EINT1!/MCIDAT1/I2STX_CLK,PORT2.12/!EINT2!/MCIDAT2/I2STX_WS,PORT2.13/!EINT3!/MCIDAT3/I2STX_SDA
PORT3.25/MAT0.0/PWM1.2,PORT3.26/MAT0.1/RXD3
PORT1.0/GPIO_SPS_DISABLE,PORT1.1/GPIO_SPS_V-IN_GOOD,PORT1.4/GPIO_SPS_5V-OUT_GOOD,PORT1.8/HAP_FAST_CHARGE,PORT1.9/ENET_RXD0,PORT1.10/!BAT_CHARGING,PORT1.14/HAP_DISABLE,PORT1.15/GPIO_SPS_5V_PWR_GOOD,PORT1.16/ENET_MDC,PORT1.17/ENET_MDIO,PORT1.18/GPIO_USB_HIGH_SPEED_SELECT,PORT1.19/CAP1.1/LED_G,PORT1.20/PWM1.2/SCK0,PORT1.21/PWM1.3/SSEL0,PORT1.22/MAT1.0/LED_R,PORT1.23/PWM1.4/MISO0,PORT1.24/PWM1.5/MOSI0,PORT1.25/MAT1.1/LED_B,PORT1.26/PWM1.6/CAP0.0,PORT1.27/CAP0.1,PORT1.28/PCAP1.0/MAT0.0,PORT1.29/PCAP1.1/MAT0.1,PORT1.30/VBUS/AD0.4,PORT1.31/SCK1/AD0.5

## Notes on the sheet
- Connect SPS_OUT to 3.3V plane via
- `PS/3.3V' jumper on bottomlayer
- User Defined
- To 5.0 V Reg
- Bypass with 0 ohm 0805 if no battery
- SPS_OUT Over Voltage Sense
- Rcb
- HAP_OUT is connected to 3.3V via the
- `HAP/3.3V' jumper on bottom layer
- CHANGE
- FOR 5V
- 3.3V on
- DEPENDS ON BATT
- DEPENDS ON BATT
- REQUIRES LPC PULL-UP
- Ext. thermistor | Thermistor
- 18.2K if SPS=3.3V
- Stuck
- Dominant Bit
- Timer
- 18k = 10V/uS
- IO Power connection
- Debug
- 1.5 MHz
- 3.3V Battery | Analog Reference
- Ext. Ref.
- Analog power connection | (-) | (+)
- (+) | User access to analog power
- Sensor (+)
- All resistors are in ohms unless otherwise noted.
- All capacitors are in microfarads unless otherwise noted.

## Library data of the parts
B2100 = psas_eagle_library:BATTERY_SINGLE_CELL_2MM
C2000 C2002-C2009 C2011 C2100-C2108 C2200-C2220 = rcl_custom:C-EU: CAPACITOR, European symbol
C2001 = rcl:CPOL-US: POLARIZED CAPACITOR, American symbol
C2010 = rcl:C-EU: CAPACITOR, European symbol
D2001 D2200-D2202 = psas_eagle_library:DIODE_SILICON-*: Generic Silicon Diode
D2002 = 0kaz:D_PDS340: 3A Shottky Barrier Rectifier Diode from Diodes inc. http://www.diodes.com/datasheets/ds30478.pdf
D2100 = custom:MA2Q705
F2000 = custom:FUSE: Fuse
FST2000 FT2001-FT2003 = mount:#4-BARE_MOUNTING_HOLE: 1/8" drill hole for #4 screw mount
J2000 = rocketbus:ROCKETBUS-PLUG
J2100 = con-molex:87758-0216: 2 Pin - 2mm Dual Row Single Wafer, Vertical T/H HDR Source: http://www.molex.com/pdm_docs/sd/877580616_sd.pdf
J2204 = ScottsLib:DEBUG-CONNECTOR
JP2200 JP2201 JP2203 JP2204 = cut-jumper:0603-B-NO-SILK-CUT-JUMPER
L2000 = choke:COIL_CMS1: Coiltronics CMS1 series common mode choke
L2001 = 0kaz:L_DR74-6R8-R: Coiltronics surface mount power inductor. DR74-XXX-X series. http://www.cooperbussmann.com/pdf/4a32919a-7470-4ae0-be45-b59e3a1351ef.pdf
L2100 = 0kaz:L_NR4018T2R2M: Power Inductor. Taiyo Yuden. 4mm x 4mm surface mount. Inductance = 2.2uH. DCRmax = 0.06 Ohms. Irated = 1.44A. Isat = 2.7A. http://www.yuden.co.jp/ut/product/pdf/enr4_e.pdf
LED2100 = led:LED: LED OSRAM: - CHIPLED LG R971, LG N971, LY N971, LG Q971, LY Q971, LO R971, LY R971 LH N974, LH R974 LS Q976, LO Q976, LY Q976 LO Q996 - Hyper CHIPLED LW Q18S LB Q993, LB Q99A, LB R99A - SideLED LS A670, LO A670, LY A670, LG A670, LP A670 LB A673, LV A673, LT A673, LW A673 LH A674 LY A675 LS A676, LA A676, LO A676, LY A676, LW A676 LS A679, LY A679, LG A679 - Hyper Micro SIDELED® LS Y876, LA Y876, LO Y876, LY Y876 LT Y87S - SmartLED LW L88C, LW L88S LB L89C, LB L89S, LG L890 LS L89K, LO L89K, LY L89K LS L896, LA L896, LO L896, LY L896 - TOPLED LS T670, LO T670, LY T670, LG T670, LP T670 LSG T670, LSP T670, LSY T670, LOP T670, LYG T670 LG T671, LOG T671, LSG T671 LB T673, LV T673, LT T673, LW T673 LH T674 LS T676, LA T676, LO T676, LY T676, LB T676, LH T676, LSB T676, LW T676 LB T67C, LV T67C, LT T67C, LS T67K, LO T67K, LY T67K, LW E67C LS E67B, LA E67B, LO E67B, LY E67B, LB E67C, LV E67C, LT E67C LW T67C LS T679, LY T679, LG T679 LS T770, LO T770, LY T770, LG T770, LP T770 LB T773, LV T773, LT T773, LW T773 LH T774 LS E675, LA E675, LY E675, LS T675 LS T776, LA T776, LO T776, LY T776, LB T776 LHGB T686 LT T68C, LB T68C - Hyper Mini TOPLED® LB M676 - Mini TOPLED Santana® LG M470 LS M47K, LO M47K, LY M47K Source: http://www.osram.convergy.de LUXEON: - LUMILED® LXK2-PW12-R00, LXK2-PW12-S00, LXK2-PW14-U00, LXK2-PW14-V00 LXK2-PM12-R00, LXK2-PM12-S00, LXK2-PM14-U00 LXK2-PE12-Q00, LXK2-PE12-R00, LXK2-PE12-S00, LXK2-PE14-T00, LXK2-PE14-U00 LXK2-PB12-K00, LXK2-PB12-L00, LXK2-PB12-M00, LXK2-PB14-N00, LXK2-PB14-P00, LXK2-PB14-Q00 LXK2-PR12-L00, LXK2-PR12-M00, LXK2-PR14-Q00, LXK2-PR14-R00 LXK2-PD12-Q00, LXK2-PD12-R00, LXK2-PD12-S00 LXK2-PH12-R00, LXK2-PH12-S00 LXK2-PL12-P00, LXK2-PL12-Q00, LXK2-PL12-R00 Source: www.luxeon.com KINGBRIGHT: KA-3528ASYC Source: www.kingbright.com
LED2101 = psas_eagle_library:LED-GRN-?
LED2200 = Tova:LED_RGB_*: RGB LED with separate contacts for all 3 chips
Q2000 Q2002 Q2200 Q2201 = Tova:PMV45EN
Q2001 Q2100 Q2101 = 0kaz:P-MOS_SI7123DN: P-MOSFET Vishay Siliconx Si7123 Rdson = 10.6 milliOhm at Vgs = -4.5V Vds max = -20V, Vgs max +- 8V, Id max = 25A, Pd max = 52W, Tj max = 33C/W
R2000-R2012 R2100-R2105 R2107-R2112 R2200-R2203 R2205-R2219 RT2100 = rcl_custom:R-US_: RESISTOR, American symbol
TP0.0 TP0.1-TP0.12 TP0.15-TP0.30 TP1.1 TP1.8-TP1.10 TP1.14-TP1.31 TP2.0 TP2.1-TP2.13 TP3.25 TP3.26 TP4.28 TP4.29 TP-AUX1 TP-AUX2 TP-AVCC TP-DBG13-TP-DBG15 TP-HAP-5V TP-NRST TP-NRST0UT TP-VBAT TP-VREF TP-VREF-GND = psas_eagle_library:PAD_ROUND: Round plated through holes of various sizes, mostly from the apc free drill list.
TVS2000 = 0kaz:TVS_SMB
TVS2200 TVS2201 = node4:IC_SN65220: SN65220 USB port transient suppressor
U2000 = node4:IC_MAX5902: MAX5902 Hot swap controller
U2001 = node4:IC_TLV3012: TLV3012 Nano power comparator with voltage reference
U2002 = 0kaz:IC_LT3972: 33V, 3.5A, 2.4MHz Step-Down Switching Regulator with 75uA Quiescent Current
U2100 = 0kaz:IC_LTC4085
U2101 = 0kaz:IC_TPS63000: Buck-Boost DC-DC converter with 1.8A switches from Texas Instruments.
U2102 = apdm:IC_74*1G74: Single D Flip-Flop in small package
U2200 = 0kaz:IC_LPC2368: LPC2368 32 bit ARM7TDMI-S processor from NXP (used to be Philps) Single chip, 32 bit microcontroller, up to 512kB flash with ISP/IAP, Ethernet, USB 2.0, CAN, and 10 bit ADC/DAC. Package is 100 pins and measures 14mm x 14mm x 1.3mm with 0.5mm pitch.
U2201 = 0kaz:IC_SN65HVD235: +3.3V CAN Transceiver with Autobaud (listen only) from TI
U2202 = 74x3g14:74LVC3G14
U2203 = 0kaz:IC_SN74LV163A: 4 BIT Synchronous Binary Counter, 3.3V, 50MHz clock max. Texas Instruments. http://focus.ti.com/lit/ds/symlink/sn74lv163a.pdf
X2200 = node4:XTAL_CM415: CM415 Surface mount crystal
X2201 = node4:XTAL_CS10: CS10 Surface mount crystal